# EAGLE design esquema-receptor (EAGLE 6.5.0)
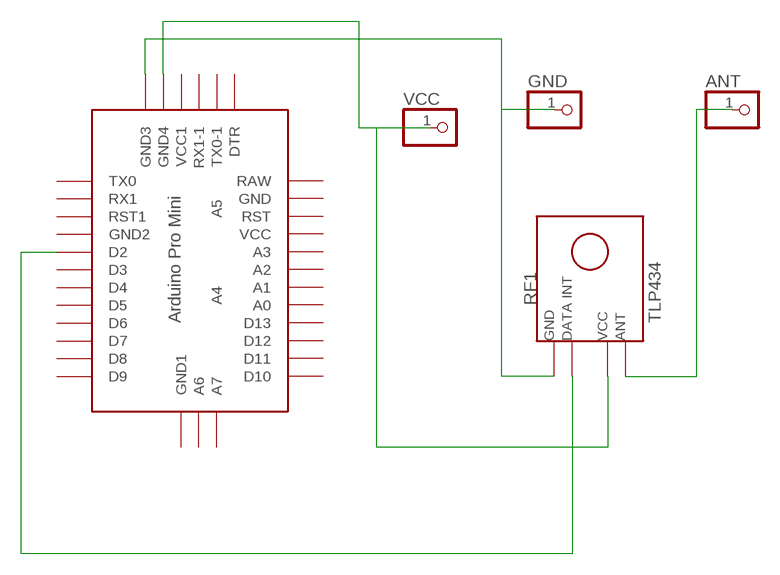
[diagram p0: schematic, sheet 1]

## Parts
ANT  PINHD-1X1  [1X01]
GND  PINHD-1X1  [1X01]
RF1  TLP434  [TLP434]
U$1  ABK-PRO-MINI  [ABK-PRO-MINI]
VCC  PINHD-1X1  [1X01]

## Nets
ANT: ANT.1 RF1.4
GND: GND.1 RF1.1 U$1.GND2(GND3)
N$1: RF1.2 U$1.D2
VCC: RF1.3 U$1.GND3(GND4) VCC.1
Unconnected: U$1.A0 U$1.A1 U$1.A2 U$1.A3 U$1.A4 U$1.A5 U$1.A6 U$1.A7 U$1.D3 U$1.D4 U$1.D5 U$1.D6 U$1.D7 U$1.D8 U$1.D9 U$1.D10 U$1.D11 U$1.D12 U$1.D13 U$1.DTR U$1.GND U$1.GND1(GND2) U$1.GND4(GND1) U$1.RAW U$1.RST U$1.RST1 U$1.RX1 U$1.RX1-1 U$1.TX0 U$1.TX0-1 U$1.VCC U$1.VCC1

## Library data of the parts
ANT GND VCC = pinhead:PINHD-1X1: PIN HEADER
RF1 = EYR_Modulos:TLP434: Transmisor de RF a 433.92MHz de la empresa LAIPAC - TLP434
U$1 = Arduino-clone:ABK-PRO-MINI: ABK Pro-Mini Arduino Clone

## Board
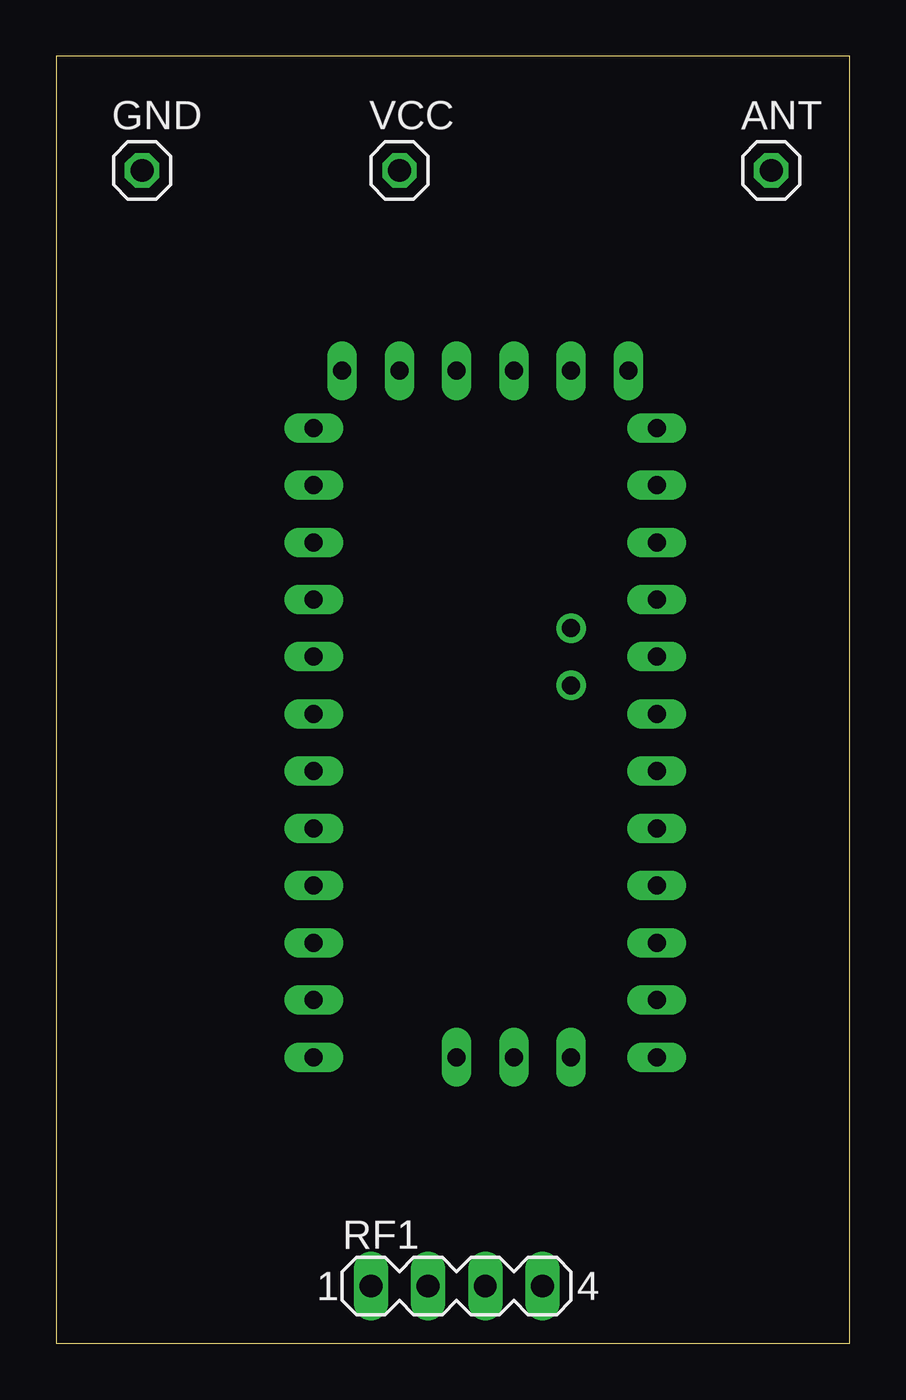
[diagram p1: board, top side]
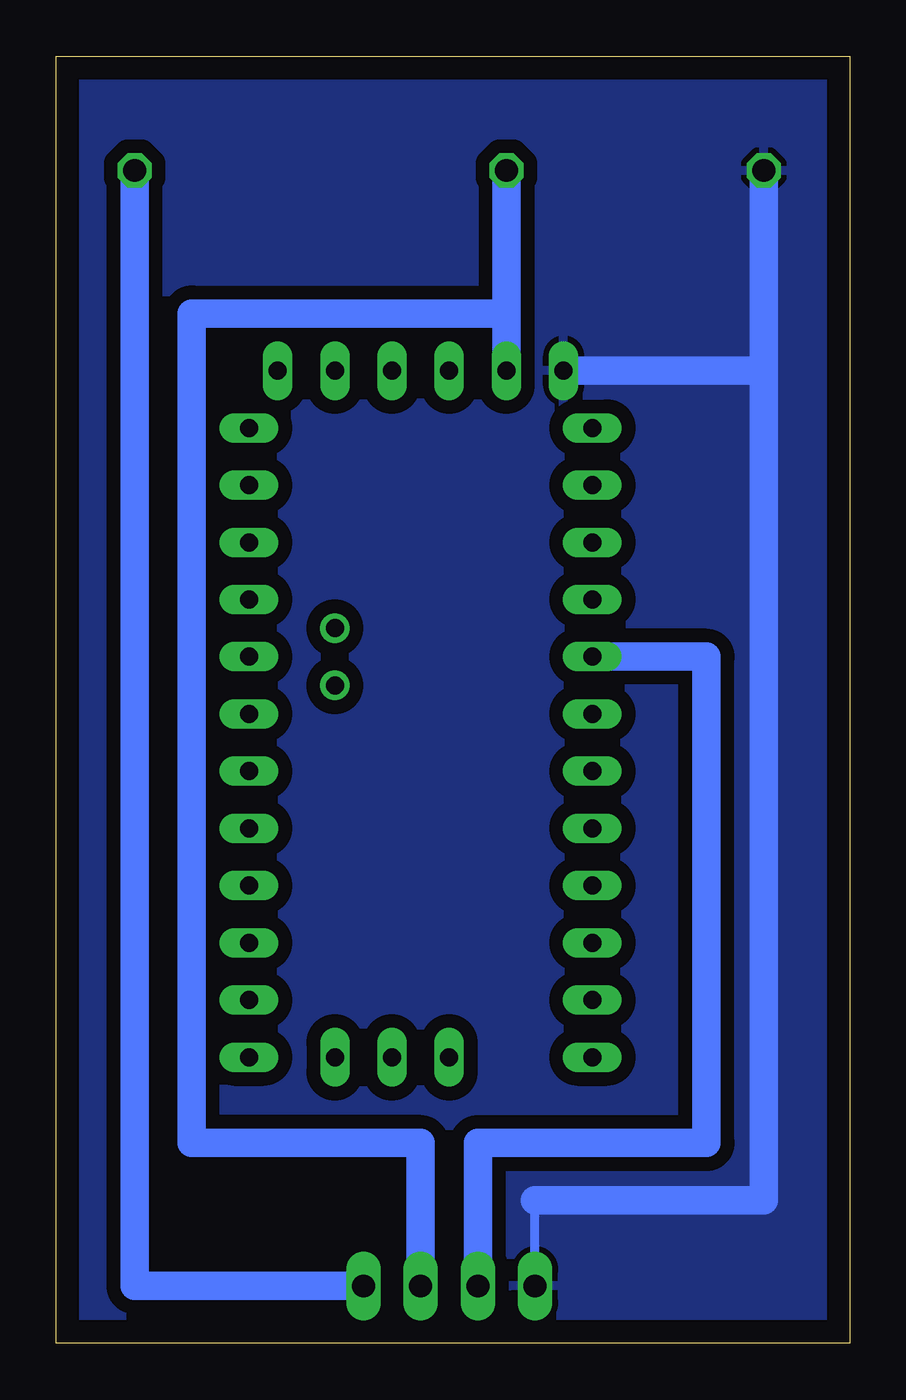
[diagram p2: board, bottom side, seen from below]

Size 35.23 x 57.14 mm. Coordinates in mm from the lower left corner, seen from the top.
Outline: 0,0 35.23,0 35.23,57.14 0,57.14 0,0
Copper layers (1*16): Top 0.035mm / dielectric 1.5mm / Bottom 0.035mm
Design rules "default": minimum track width 10mil, minimum drill 24mil, track to track 8mil, track to pad 8mil, pad to pad 8mil, via to via 8mil, smd to smd 8mil, copper to edge 40mil, drill to drill 8mil, minimum pad ring 10mil, minimum via ring 8mil, stop-mask expansion 4mil, vias tented up to drill 0mil, thermal gap 10mil

### Footprints (pad centres in the part's own frame; a part is rotated, then mirrored left to right if it is on the bottom)
1X01 = drill 1.016 octagon: 1 0,0
TLP434 = drill 1.016 long: 1 -3.81,0; 2 -1.27,0; 3 1.27,0; 4 3.81,0
ABK-PRO-MINI = drill 0.8 long: A0 10.16,-3.81; A1 10.16,-6.35; A2 10.16,-8.89; A3 10.16,-11.43; A6 3.81,-21.59; A7 6.35,-21.59; D2 -5.08,-3.81; D3 -5.08,-6.35; D4 -5.08,-8.89; D5 -5.08,-11.43; D6 -5.08,-13.97; D7 -5.08,-16.51; D8 -5.08,-19.05; D9 -5.08,-21.59; D10 10.16,-21.59; D11 10.16,-19.05; D12 10.16,-16.51; D13 10.16,-13.97; DTR 8.89,8.89; GND 10.16,3.81; GND1 -5.08,-1.27; GND2 -3.81,8.89; GND3 -1.27,8.89; GND4 1.27,-21.59; RAW 10.16,6.35; RST 10.16,1.27; RST1 -5.08,1.27; RX1 -5.08,3.81; RX1-1 3.81,8.89; TX0 -5.08,6.35; TX0-1 6.35,8.89; VCC 10.16,-1.27; VCC1 1.27,8.89 | drill 0.8: A4 6.35,-5.08; A5 6.35,-2.54

### Placement (x,y rotation side)
ANT  31.75,52.07 0 top
GND  3.81,52.07 0 top
RF1  17.78,2.54 0 top
U$1  16.51,34.29 0 top
VCC  15.24,52.07 0 top

### Tracks (layer width: path | path; a pad name or v marks a point on that pad's centre or on a via)
ANT
  Bottom 1.27: RF1.4 31.75,2.54 ANT.1
GND
  Bottom 0.406: RF1.1 13.97,6.35
  Bottom 1.27: 13.97,6.35 3.81,6.35 3.81,43.18 | 3.81,43.18 GND.1 | U$1.GND2 3.81,43.18
  pour Bottom (isolate 0.61): 0,57.15 35.56,57.15 35.56,0 0,0
N$1
  Bottom 1.27: RF1.2 16.51,8.89 6.35,8.89 6.35,30.48 U$1.D2
VCC
  Bottom 1.27: VCC.1 15.24,45.72 | 15.24,45.72 U$1.GND3 | RF1.3 19.05,8.89 29.21,8.89 29.21,45.72 15.24,45.72